# Altium schematic sheet 3.3V_to_DDR4_VDD.SchDoc: 3.3V to VDD converter
size B; DocumentNumber: 42; SheetNumber: 42; SheetTotal: 46
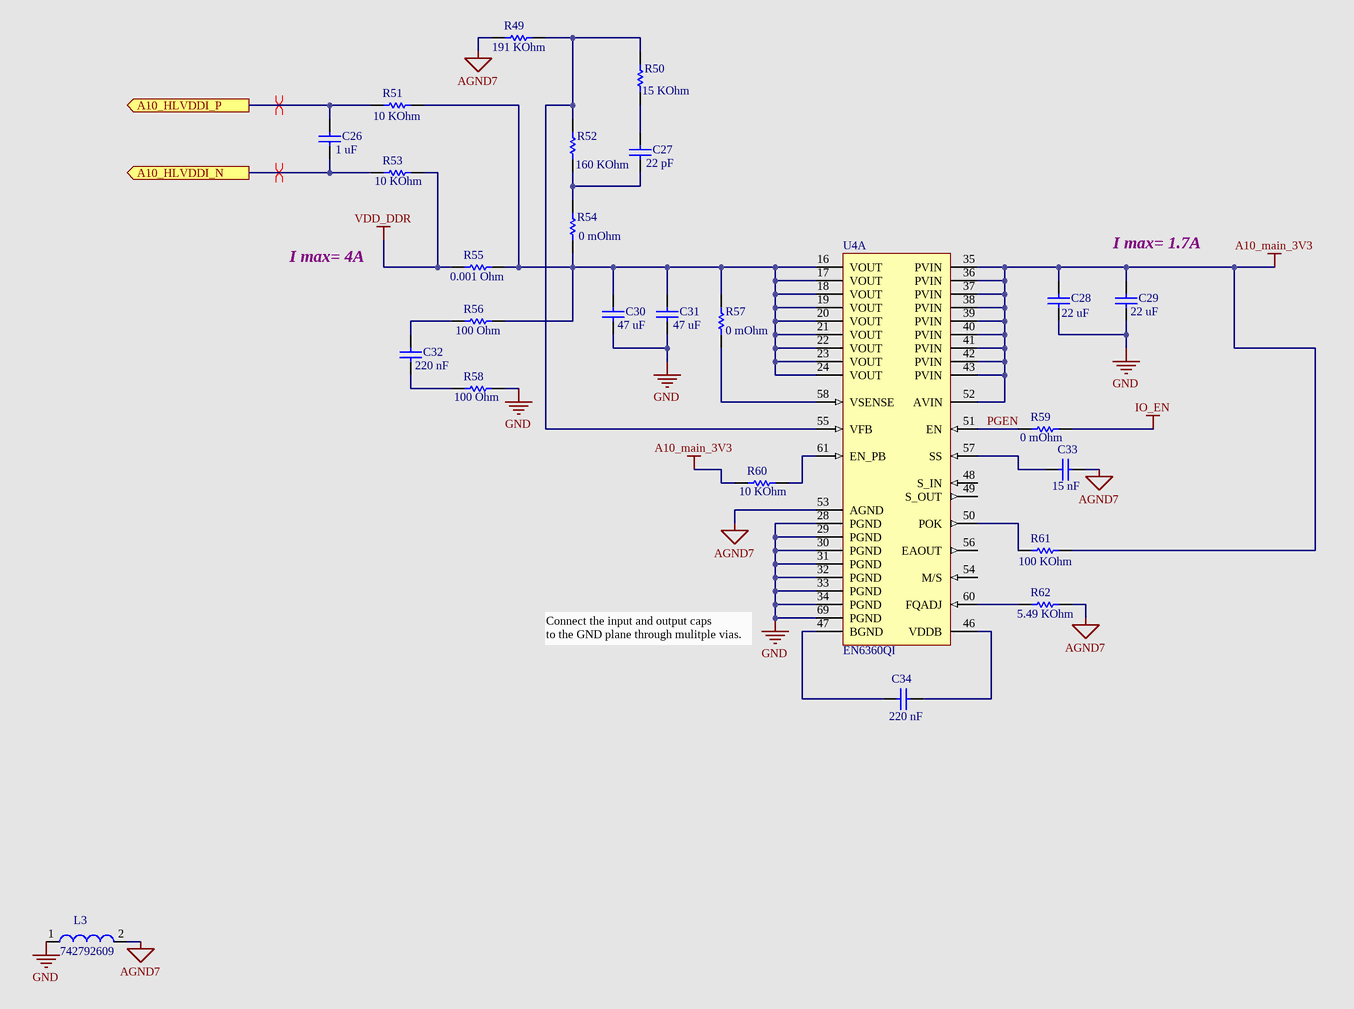
[diagram p0: 3.3V_to_DDR4_VDD.SchDoc]

## Parts
C26  Capacitance: 1 uF  [CAPC1005X33X10LL5]  (hidden comment: CGB2A1X5R1E105K033BC)
C27  Capacitance: 22 pF  [CAPC1005X55X10LL05]  (hidden comment: C1005C0G1H220J050BA)
C28  Capacitance: 22 uF  [CAPC3216X180X55ML20T25]  (hidden comment: GRM31CR61E226KE15L)
C29  Capacitance: 22 uF  [CAPC3216X180X55ML20T25]  (hidden comment: GRM31CR61E226KE15L)
C30  Capacitance: 47 uF  [CAPC3216X180X20ML20]  (hidden comment: C3216X5R1A476M160AB)
C31  Capacitance: 47 uF  [CAPC3216X180X20ML20]  (hidden comment: C3216X5R1A476M160AB)
C32  Capacitance: 220 nF  [CAPC1005X55X25NL05T10]  (hidden comment: GRM155R61A224KE19D)
C33  Capacitance: 15 nF  [CAPC1005X55X23ML05T8]  (hidden comment: VJ0402Y153JXQPW1BC)
C34  Capacitance: 220 nF  [CAPC1005X55X25NL05T10]  (hidden comment: GRM155R61A224KE19D)
L3  742792609  [SMD-0603]
R49  Resistance: 191 KOhm  [RESC1005X40X25LL05T05]  (hidden comment: CRCW0402191KFKED)
R50  Resistance: 15 KOhm  [RESC1005X40X25ML05T05]  (hidden comment: ERJ-2RKF1502X)
R51  Resistance: 10 KOhm  [RESC1005X40X25NL05T05]  (hidden comment: ERJ-2RKF1002X)
R52  Resistance: 160 KOhm  [RESC1005X40X25ML05T05]  (hidden comment: CRCW0402160KFKED)
R53  Resistance: 10 KOhm  [RESC1005X40X25NL05T05]  (hidden comment: ERJ-2RKF1002X)
R54  Resistance: 0 mOhm  [RESC1005X40X25ML05T05]  (hidden comment: ERJ-2GE0R00X)
R55  Resistance: 0.001 Ohm  [RESC3216X89X104LL25T25]  (hidden comment: WSLP12061L000FEA)
R56  Resistance: 100 Ohm  [RESC1005X40X25LL05T05]  (hidden comment: ERJ-2RKF1000X)
R57  Resistance: 0 mOhm  [RESC1005X40X25ML05T05]  (hidden comment: ERJ-2GE0R00X)
R58  Resistance: 100 Ohm  [RESC1005X40X25LL05T05]  (hidden comment: ERJ-2RKF1000X)
R59  Resistance: 0 mOhm  [RESC1005X40X25ML05T05]  (hidden comment: ERJ-2GE0R00X)
R60  Resistance: 10 KOhm  [RESC1005X40X25NL05T05]  (hidden comment: ERJ-2RKF1002X)
R61  Resistance: 100 KOhm  [RESC1005X40X25LL05T05]  (hidden comment: ERJ-2RKF1003X)
R62  Resistance: 5.49 KOhm  [RESC1005X40X25NL05T05]  (hidden comment: ERJ-2RKF5491X)
U4  EN6360QI  [ALTR-QFN-68_A-305_V]  (part A of 2)

## Ports
A10_HLVDDI_N (out), A10_HLVDDI_P (out)

## Nets
A10_main_3V3: C28.2 C29.2 R60.1 R61.2 U4.35(PVIN) U4.36(PVIN) U4.37(PVIN) U4.38(PVIN) U4.39(PVIN) U4.40(PVIN) U4.41(PVIN) U4.42(PVIN) U4.43(PVIN) U4.52(AVIN)
AGND7: C33.1 L3.2 R49.1 R62.2 U4.53(AGND)
GND: C28.1 C29.1 C30.1 C31.1 L3.1 R58.1 U4.28(PGND) U4.29(PGND) U4.30(PGND) U4.31(PGND) U4.32(PGND) U4.33(PGND) U4.34(PGND) U4.69(PGND)
IO_EN: R59.2
VDD_DDR: R53.2 R55.1
A10_HLVDDI_N: C26.1 R53.1 ; port A10_HLVDDI_N
A10_HLVDDI_P: C26.2 R51.1 ; port A10_HLVDDI_P
PGEN: R59.1 U4.51(EN)
NetC27_1: C27.1 R52.1 R54.2
NetC27_2: C27.2 R50.1
NetC30_2: C30.2 C31.2 R51.2 R54.1 R55.2 R56.1 R57.2 U4.16(VOUT) U4.17(VOUT) U4.18(VOUT) U4.19(VOUT) U4.20(VOUT) U4.21(VOUT) U4.22(VOUT) U4.23(VOUT) U4.24(VOUT)
NetC32_1: C32.1 R56.2
NetC32_2: C32.2 R58.2
NetC33_2: C33.2 U4.57(SS)
NetC34_1: C34.1 U4.47(BGND)
NetC34_2: C34.2 U4.46(VDDB)
NetR49_2: R49.2 R50.2 R52.2 U4.55(VFB)
NetR57_1: R57.1 U4.58(VSENSE)
NetR60_2: R60.2 U4.61(EN_PB)
NetR61_1: R61.1 U4.50(POK)
NetR62_1: R62.1 U4.60(FQADJ)

Not connected (* = marked no-connect by the designer): U4 48(S_IN) 49(S_OUT) 54(M/S) 56(EAOUT)

## Layout directives
differential pair: A10_HLVDDI_N, A10_HLVDDI_P

## Notes on the sheet
- I max= 4A
- (near C29) I max= 1.7A
- Connect the input and output caps
  to the GND plane through mulitple vias.
- Title
- Size:
- Date:
- B
- Number:
- Time:
- Revision:
- Sheet
- of
- File:

## Library data of the parts
C26 = CMP-1663-00006-2: Chip Capacitor, 1 uF, +/- 10%, 25 V, -55 to 85 degC, 0402 (1005 Metric), RoHS, Tape and Reel; Tolerance: 10%; PackageDescription: 2-Pin Surface Mount Device, Body 1 x 0.5 mm; PartNumber: CGB2A1X5R1E105K033BC; Case Code (Metric): 1005; DatasheetVersion: 04/2015; RoHSCompliant: True; Max Operating Temperature: 85 degC; ComponentLink2URL: https://product.tdk.com/info/en/catalog/datasheets/mlcc_commercial_lowprofile_en.pdf; Package Quantity: 1; Width: 0.02 inch; Case/Package: 0402; Case Code (Imperial): 0402; Packaging: Tape and Reel; Length: 0.039 inch; Min Operating Temperature: -55 degC; Mounting Technology: Surface Mount; ComponentLink2Description: Datasheet; ComponentLink1URL: http://www.tdk.com/; ComponentLink1Description: Manufacturer URL
C27 = CMP-1663-00008-2: Chip Capacitor, 22 pF, +/- 5%, 50 V, -55 to 125 degC, 0402 (1005 Metric), RoHS, Tape and Reel; Type (Capacitors): C0G; Voltage Rating: 50 V; Case\/Package: 0402; Tolerance: 5%; ComponentLink2URL: https://product.tdk.com/info/en/catalog/datasheets/mlcc_commercial_general_en.pdf; RoHSCompliant: true; Mounting Technology: Surface Mount; Case Code (Metric): 1005; PackageDescription: 2-Pin Surface Mount Device, Body 1 x 0.5 mm; ComponentLink1URL: http://www.tdk.com/; Packaging: Tape and Reel; ComponentLink1Description: Manufacturer URL; PackageReference: 0402; Package Quantity: 10000; DatasheetVersion: 08/2016; Width: 0.5 mm; Max Operating Temperature: 125 degC; Mount: Surface Mount; Height: 0.5 mm; REACH SVHC: No SVHC; Length: 1 mm; Min Operating Temperature: -55 degC; Pins: 2; Case Code (Imperial): 0402; Radiation Hardening: No; ComponentLink2Description: Datasheet; Voltage Rating (DC): 50 V; PartNumber: C1005C0G1H220J050BA
C28 C29 = CMP-1662-00010-2: Chip Capacitor, 22 uF, +/- 10%, 25 V, -55 to 85 degC, 1206 (3216 Metric), RoHS, Tape and Reel; Voltage Rating (DC): 25 V; Case\/Package: 1206; Type (Capacitors): X5R; Tolerance: 10%; Max Operating Temperature: 85 degC; Package Quantity: 2000; Voltage Rating: 25 V; Case Code (Metric): 3216; Length: 3.2 mm; PackageDescription: 2-Pin Surface Mount Device, Body 3.2 x 1.6 mm; ComponentLink1Description: Manufacturer URL; Case Code (Imperial): 1206; ComponentLink1URL: http://www.murata.com/; Radiation Hardening: No; Height: 1.6 mm; Width: 1.6 mm; DatasheetVersion: 03/2016; Min Operating Temperature: -55 degC; Mount: Surface Mount; REACH SVHC: No SVHC; PackageReference: 1206; ComponentLink2URL: http://search.murata.co.jp/Ceramy/image/img/A01X/G101/ENG/GRM31CR61E226KE15-01.pdf; Packaging: Tape and Reel; RoHSCompliant: true; ComponentLink2Description: Datasheet; Mounting Technology: Surface Mount; PartNumber: GRM31CR61E226KE15L; Pins: 2
C30 C31 = CMP-1663-00005-1: Chip Capacitor, 47 uF, +/- 20%, 10 V, -55 to 85 degC, 1206 (3216 Metric), RoHS, Tape and Reel; Voltage Rating (DC): 10 V; Type (Capacitors): X5R; Case\/Package: 1206; Tolerance: 20%; Voltage Rating: 10 V; Packaging: Tape and Reel; ComponentLink2URL: https://product.tdk.com/info/en/catalog/datasheets/mlcc_commercial_general_en.pdf; Min Operating Temperature: -55 degC; Length: 3.2 mm; Radiation Hardening: No; Mounting Technology: Surface Mount; PackageDescription: 2-Pin Surface Mount Device, Body 3.2 x 1.6 mm; Max Operating Temperature: 85 degC; Case Code (Metric): 3216; ComponentLink1URL: http://www.tdk.com/; DatasheetVersion: 03/2015; Mount: Surface Mount; Case Code (Imperial): 1206; Package Quantity: 2000; ComponentLink2Description: Datasheet; PackageReference: 3216; Height: 1.6 mm; RoHSCompliant: true; Width: 1.6 mm; ComponentLink1Description: Manufacturer URL
C32 C34 = CMP-2008-04561-4: Chip Capacitor, 220 nF, +/- 10%, 10 V, -55 to 85 degC, 0402 (1005 Metric), RoHS, Tape and Reel; Manufacturer: Basic Passives; Voltage Rating: 10 V; Case\/Package: 0402; Type (Capacitors): X5R; ComponentLink1URL: http://www.murata.com/; Package Quantity: 1; Tolerance: 10%; Mounting Technology: Surface Mount; RoHSCompliant: true; PartNumber: GRM155R61A224KE19D; Max Operating Temperature: 85 degC; Case Code (Imperial): 0402; Length: 1 mm; Packaging: Tape and Reel; Min Operating Temperature: -55 degC; PackageDescription: 2-Pin Surface Mount Device, Body 1 x 0.5 mm; Height: 0.5 mm; Case Code (Metric): 1005; REACH SVHC: No SVHC; ComponentLink1Description: Manufacturer URL; Width: 0.5 mm; ComponentLink2URL: http://search.murata.co.jp/Ceramy/image/img/A01X/G101/ENG/GRM155R61A224KE19-01.pdf; Radiation Hardening: No; Pins: 2; Voltage Rating (DC): 10 V; DatasheetVersion: 03/2016; Mount: Surface Mount; PackageReference: 0402; ComponentLink2Description: Datasheet
C33 = CMP-1666-00015-3: Chip Capacitor, 15 nF, +/- 5%, 10 V, -55 to 125 degC, 0402 (1005 Metric), RoHS, Tape and Reel; Voltage Rating (DC): 10 V; Type (Capacitors): X7R; Case\/Package: 0402; DatasheetVersion: 07/2016; ComponentLink1Description: Manufacturer URL; ComponentLink1URL: http://www.vishay.com/; PackageDescription: 2-Pin Surface Mount Device, Body 1 x 0.5 mm; ComponentLink2URL: http://www.vishay.com/docs/28548/vjw1bcbascomseries.pdf; ComponentLink2Description: Datasheet; Mounting Technology: Surface Mount; Length: 1 mm; PartNumber: VJ0402Y153JXQPW1BC; RoHSCompliant: true; Package Quantity: 50000; Min Operating Temperature: -55 degC; Case Code (Metric): 1005; Max Operating Temperature: 125 degC; Width: 0.5 mm; Tolerance: 5%; Packaging: Tape and Reel; Case Code (Imperial): 0402; Height: 0.5 mm; PackageReference: 0402; Mount: Surface Mount; Pins: 2; Voltage Rating: 10 V
L3 = CMP-0220-00193-1: SMD EMI Suppression Ferrite Bead WE-CBF, Z = 30 Ohm; Impedance: 30 Ohm; ComponentLink2URL: http://www.we-online.de/katalog/media/pdf/742792609.pdf; ComponentLink1URL: http://www.we-online.com; ComponentLink2Description: Datasheet; PackageDescription: Chip Inductor, 2-Leads, Body 1.6 x 0.8 mm; ComponentLink1Description: Manufacturer Link; PackageReference: SMD-0603; DatasheetVersion: Dec-2005; PackageVersion: 2009
R49 = CMP-2002-08268-3: Chip Resistor, 191 KOhm, +/- 1%, 63 mW, -55 to 155 degC, 0402 (1005 Metric), RoHS, Tape and Reel; Manufacturer: Basic Passives; Voltage Rating: 50 V; Power Rating: 63 mW; Case\/Package: 0402; Case Code (Imperial): 0402; Height: 0.35 mm; PackageDescription: 2-Pin Surface Mount Device, Body 1 x 0.5 mm; REACH SVHC: Unknown; ComponentLink1URL: http://www.vishay.com/; Tolerance: 1%; Width: 0.5 mm; Package Quantity: 10000; ComponentLink1Description: Manufacturer URL; Packaging: Tape and Reel; Min Operating Temperature: -55 degC; Length: 1 mm; Case Code (Metric): 1005; Max Operating Temperature: 155 degC; Mounting Technology: Surface Mount; Mount: Surface Mount; RoHSCompliant: true; PartNumber: CRCW0402191KFKED; Weight: 2.3E-05oz; ComponentLink2URL: http://www.vishay.com/docs/20035/dcrcwe3.pdf; DatasheetVersion: 06/2012; ComponentLink2Description: Datasheet; Radiation Hardening: No; PackageReference: 0402; Pins: 2
R50 = CMP-2002-00694-3: Chip Resistor, 15 KOhm, +/- 1%, 100 mW, -55 to 155 degC, 0402 (1005 Metric), RoHS, Tape and Reel; Manufacturer: Basic Passives; Power Rating: 100 mW; Voltage Rating: 50 V; Case\/Package: 0402; Max Operating Temperature: 155 degC; Case Code (Imperial): 0402; Case Code (Metric): 1005; PartNumber: ERJ-2RKF1502X; Package Quantity: 10000; REACH SVHC: Yes; Width: 0.5 mm; Mount: Surface Mount; Mounting Technology: Surface Mount; Packaging: Tape and Reel; Tolerance: 1%; ComponentLink1Description: Manufacturer URL; ComponentLink1URL: http://www.panasonic.com/; Height: 0.35 mm; Length: 1 mm; PackageDescription: 2-Pin Surface Mount Device, Body 1 x 0.5 mm; Min Operating Temperature: -55 degC; RoHSCompliant: true; Pins: 2; PackageReference: 0402; DatasheetVersion: 04/2015; ComponentLink2URL: http://industrial.panasonic.com/cdbs/www-data/pdf/RDA0000/AOA0000C86.pdf; Weight: 2.8E-05oz; Radiation Hardening: No; ComponentLink2Description: Datasheet
R51 R53 R60 = CMP-2002-00607-3: Chip Resistor, 10 KOhm, +/- 1%, 100 mW, -55 to 155 degC, 0402 (1005 Metric), RoHS, Tape and Reel; Manufacturer: Basic Passives; Voltage Rating: 50 V; Power Rating: 100 mW; Case\/Package: 0402; Case Code (Imperial): 0402; Min Operating Temperature: -55 degC; PartNumber: ERJ-2RKF1002X; Mounting Technology: Surface Mount; Length: 1 mm; Packaging: Tape and Reel; ComponentLink1Description: Manufacturer URL; Mount: Surface Mount; Package Quantity: 10000; Max Operating Temperature: 155 degC; Case Code (Metric): 1005; Height: 0.35 mm; ComponentLink1URL: http://www.panasonic.com/; Tolerance: 1%; REACH SVHC: Yes; RoHSCompliant: true; Width: 0.5 mm; PackageDescription: 2-Pin Surface Mount Device, Body 1 x 0.5 mm; Radiation Hardening: No; PackageReference: 0402; ComponentLink2Description: Datasheet; DatasheetVersion: 04/2015; ComponentLink2URL: http://industrial.panasonic.com/cdbs/www-data/pdf/RDA0000/AOA0000C86.pdf; Pins: 2
R52 = CMP-2002-08227-3: Chip Resistor, 160 KOhm, +/- 1%, 63 mW, -55 to 155 degC, 0402 (1005 Metric), RoHS, Tape and Reel; Manufacturer: Basic Passives; Power Rating: 63 mW; Voltage Rating: 50 V; Case\/Package: 0402; Tolerance: 1%; Min Operating Temperature: -55 degC; Length: 1 mm; Height: 0.35 mm; Package Quantity: 10; Mounting Technology: Surface Mount; Mount: Surface Mount; Max Operating Temperature: 155 degC; PartNumber: CRCW0402160KFKED; Case Code (Imperial): 0402; Packaging: Tape and Reel; ComponentLink1Description: Manufacturer URL; Case Code (Metric): 1005; ComponentLink1URL: http://www.vishay.com/; RoHSCompliant: true; REACH SVHC: Unknown; PackageDescription: 2-Pin Surface Mount Device, Body 1 x 0.5 mm; Width: 0.5 mm; ComponentLink2Description: Datasheet; Pins: 2; PackageReference: 0402; Weight: 2.3E-05oz; ComponentLink2URL: http://www.vishay.com/docs/20035/dcrcwe3.pdf; Radiation Hardening: No; DatasheetVersion: 06/2012
R54 R57 R59 = CMP-2002-00429-3: Chip Resistor, 0 mOhm, +/- 5%, 100 mW, -55 to 155 degC, 0402 (1005 Metric), RoHS, Tape and Reel; Manufacturer: Basic Passives; Power Rating: 100 mW; Voltage Rating: 50 V; Case\/Package: 0402; Max Operating Temperature: 155 degC; Tolerance: 5%; PartNumber: ERJ-2GE0R00X; Case Code (Imperial): 0402; Package Quantity: 10000; Length: 1 mm; Mounting Technology: Surface Mount; ComponentLink1URL: http://www.panasonic.com/; Height: 0.35 mm; Width: 0.5 mm; Min Operating Temperature: -55 degC; Case Code (Metric): 1005; RoHSCompliant: true; REACH SVHC: Unknown; ComponentLink1Description: Manufacturer URL; Packaging: Tape and Reel; Mount: Surface Mount; PackageDescription: 2-Pin Surface Mount Device, Body 1 x 0.5 mm; PackageReference: 0402; ComponentLink2URL: http://industrial.panasonic.com/cdbs/www-data/pdf/RDA0000/AOA0000C84.pdf; DatasheetVersion: 03/2015; Radiation Hardening: No; Pins: 2; ComponentLink2Description: Datasheet
R55 = CMP-1666-00018-2: Chip Resistor, 0.001 Ohm, +/- 1%, 1 W, -65 to 170 degC, 1206 (3216 Metric), RoHS, Tape and Reel; Tolerance: 1%; RoHSCompliant: True; Mounting Technology: Surface Mount; ComponentLink1URL: http://www.vishay.com/; Min Operating Temperature: -65 degC; Height: 0.635 mm; ComponentLink2URL: http://www.farnell.com/datasheets/2049155.pdf; Length: 3.2 mm; ComponentLink2Description: Datasheet; ComponentLink1Description: Manufacturer URL; DatasheetVersion: 04/2015; Case Code (Imperial): 1206; Max Operating Temperature: 170 degC; Packaging: Tape and Reel; Case/Package: 1206; Width: 1.6 mm; PartNumber: WSLP12061L000FEA; REACH SVHC: Unknown; PackageDescription: 2-Pin Surface Mount Device, Body 3.2 x 1.6 mm; Case Code (Metric): 3216
R56 R58 = CMP-2002-00605-3: Chip Resistor, 100 Ohm, +/- 1%, 100 mW, -55 to 155 degC, 0402 (1005 Metric), RoHS, Tape and Reel; Manufacturer: Basic Passives; Voltage Rating: 50 V; Power Rating: 100 mW; Case\/Package: 0402; ComponentLink1URL: http://www.panasonic.com/; Package Quantity: 10000; Packaging: Tape and Reel; PackageDescription: 2-Pin Surface Mount Device, Body 1 x 0.5 mm; Tolerance: 1%; ComponentLink1Description: Manufacturer URL; REACH SVHC: Yes; Case Code (Imperial): 0402; Mounting Technology: Surface Mount; Min Operating Temperature: -55 degC; RoHSCompliant: true; Length: 1 mm; Width: 0.5 mm; Height: 0.35 mm; Max Operating Temperature: 155 degC; PartNumber: ERJ-2RKF1000X; Mount: Surface Mount; Case Code (Metric): 1005; Pins: 2; ComponentLink2Description: Datasheet; PackageReference: 0402; DatasheetVersion: 04/2015; Radiation Hardening: No; ComponentLink2URL: http://industrial.panasonic.com/cdbs/www-data/pdf/RDA0000/AOA0000C86.pdf
R61 = CMP-2002-00608-3: Chip Resistor, 100 KOhm, +/- 1%, 100 mW, -55 to 155 degC, 0402 (1005 Metric), RoHS, Tape and Reel; Manufacturer: Basic Passives; Voltage Rating: 50 V; Power Rating: 100 mW; Case\/Package: 0402; Height: 0.35 mm; ComponentLink1Description: Manufacturer URL; Packaging: Tape and Reel; Min Operating Temperature: -55 degC; RoHSCompliant: true; PackageDescription: 2-Pin Surface Mount Device, Body 1 x 0.5 mm; Mount: Surface Mount; Package Quantity: 10000; Max Operating Temperature: 155 degC; ComponentLink1URL: http://www.panasonic.com/; Tolerance: 1%; Mounting Technology: Surface Mount; PartNumber: ERJ-2RKF1003X; Case Code (Metric): 1005; Case Code (Imperial): 0402; REACH SVHC: Yes; Length: 1 mm; Width: 0.5 mm; DatasheetVersion: 04/2015; Pins: 2; ComponentLink2Description: Datasheet; ComponentLink2URL: http://industrial.panasonic.com/cdbs/www-data/pdf/RDA0000/AOA0000C86.pdf; PackageReference: 0402; Radiation Hardening: No
R62 = CMP-2002-00990-3: Chip Resistor, 5.49 KOhm, +/- 1%, 100 mW, -55 to 155 degC, 0402 (1005 Metric), RoHS, Tape and Reel; Manufacturer: Basic Passives; Voltage Rating: 50 V; Power Rating: 100 mW; Case\/Package: 0402; Tolerance: 1%; Packaging: Tape and Reel; RoHSCompliant: true; Length: 0.039 inch; PackageDescription: 2-Pin Surface Mount Device, Body 1 x 0.5 mm; Height: 0.016 inch; Case Code (Imperial): 0402; Min Operating Temperature: -55 degC; PartNumber: ERJ-2RKF5491X; Case Code (Metric): 1005; ComponentLink1Description: Manufacturer URL; Width: 0.02 inch; Package Quantity: 10000; ComponentLink1URL: http://www.panasonic.com/; Mount: Surface Mount; Mounting Technology: Surface Mount; REACH SVHC: Yes; Max Operating Temperature: 155 degC; ComponentLink2URL: http://industrial.panasonic.com/cdbs/www-data/pdf/RDA0000/AOA0000C86.pdf; Pins: 2; ComponentLink2Description: Datasheet; PackageReference: 0402; DatasheetVersion: 04/2015
U4 = CMP-1689-00004-3: PowerSoC Highly Integrated Synchronous DC-DC Buck with Integrated Inductor, 2.5 to 6.6 V Input, -40 to 85 degC, 68-Pin QFN, RoHS, Tape and Reel; Output Current: 8 A; Mounting Technology: Surface Mount; ComponentLink2URL: https://www.altera.com/content/dam/altera-www/global/en_US/pdfs/literature/ds/en6360qi_06489.pdf; PackageVersion: Rev. A, 10/2014; ComponentLink3Description: Package Specification; ComponentLink3URL: http://wl.altera.com/literature/ds/EN6360QA_10396.pdf; ComponentLink1Description: Manufacturer URL; PartNumber: EN6360QI; ComponentLink2Description: Datasheet; PackageDescription: 68-Pin Quad-Flat No-Leads Package, Body 11 x 8 mm, Pitch 0.5 mm; ComponentLink1URL: https://www.altera.com/; Code_JEDEC: J-STD-020A; DatasheetVersion: Rev. G; Mount: Surface Mount; Max Operating Temperature: 85 degC; Pins: 68; Radiation Hardening: No; Min Operating Temperature: -40 degC; Packaging: Tape and Reel; Package Quantity: 250; RoHSCompliant: True; Width: 0.32 inch; Length: 0.43 inch; Height: 0.12 inch